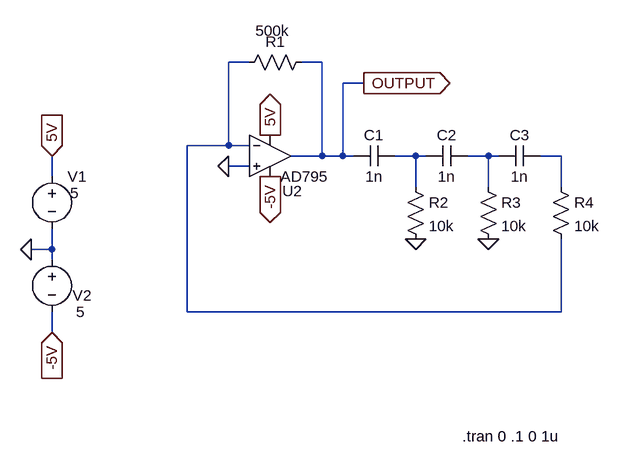
[diagram p0: schematic Phase shift oscillator.asc]
Phase shift oscillator.asc, the LTspice schematic file:
Version 4
SHEET 1 2604 1992
WIRE 160 -144 128 -144
WIRE 272 -144 240 -144
WIRE 336 -112 304 -112
WIRE 128 -16 128 -144
WIRE 128 -16 64 -16
WIRE 160 -16 128 -16
WIRE 272 0 272 -144
WIRE 272 0 224 0
WIRE 304 0 304 -112
WIRE 304 0 272 0
WIRE 320 0 304 0
WIRE 416 0 384 0
WIRE 432 0 416 0
WIRE 528 0 496 0
WIRE 544 0 528 0
WIRE 640 0 608 0
WIRE 160 16 128 16
WIRE -144 32 -144 0
WIRE 416 48 416 0
WIRE 528 48 528 0
WIRE 640 48 640 0
WIRE -144 144 -144 112
WIRE -144 144 -176 144
WIRE -144 160 -144 144
WIRE 64 240 64 -16
WIRE 640 240 640 128
WIRE 640 240 64 240
WIRE -144 272 -144 240
FLAG -144 272 -5V
IOPIN -144 272 In
FLAG -176 144 0
FLAG -144 0 5V
IOPIN -144 0 In
FLAG 192 -32 5V
IOPIN 192 -32 Out
FLAG 192 32 -5V
IOPIN 192 32 Out
FLAG 128 16 0
FLAG 416 128 0
FLAG 528 128 0
FLAG 336 -112 OUTPUT
IOPIN 336 -112 Out
SYMBOL voltage -144 16 R0
WINDOW 3 28 41 Left 2
WINDOW 123 0 0 Left 2
WINDOW 39 0 0 Left 2
SYMATTR Value 5
SYMATTR InstName V1
SYMBOL voltage -144 144 R0
WINDOW 0 32 71 Left 2
WINDOW 3 37 96 Left 2
WINDOW 123 0 0 Left 2
WINDOW 39 0 0 Left 2
SYMATTR InstName V2
SYMATTR Value 5
SYMBOL Opamps\\AD795 192 -64 R0
WINDOW 0 19 118 Left 2
SYMATTR InstName U2
SYMBOL res 256 -160 R90
WINDOW 0 0 56 VBottom 2
WINDOW 3 -48 60 VTop 2
SYMATTR InstName R1
SYMATTR Value 500k
SYMBOL cap 384 -16 R90
WINDOW 0 0 32 VBottom 2
WINDOW 3 32 32 VTop 2
SYMATTR InstName C1
SYMATTR Value 1n
SYMBOL cap 496 -16 R90
WINDOW 0 0 32 VBottom 2
WINDOW 3 32 32 VTop 2
SYMATTR InstName C2
SYMATTR Value 1n
SYMBOL cap 608 -16 R90
WINDOW 0 0 32 VBottom 2
WINDOW 3 32 32 VTop 2
SYMATTR InstName C3
SYMATTR Value 1n
SYMBOL res 400 32 R0
SYMATTR InstName R2
SYMATTR Value 10k
SYMBOL res 512 32 R0
SYMATTR InstName R3
SYMATTR Value 10k
SYMBOL res 624 32 R0
SYMATTR InstName R4
SYMATTR Value 10k
TEXT 488 432 Left 2 !.tran 0 .1 0 1u

The netlist it stands for:
* Phase shift oscillator.asc
V1 5V 0 5
V2 0 -5V 5
XU2 0 N001 5V -5V OUTPUT AD795  ; pins In+ In- V+ V- OUT
R1 OUTPUT N001 500k
C1 N002 OUTPUT 1n
C2 N003 N002 1n
C3 N004 N003 1n
R2 N002 0 10k
R3 N003 0 10k
R4 N004 N001 10k
.tran 0 .1 0 1u
.lib ADI1.lib
.backanno
.end